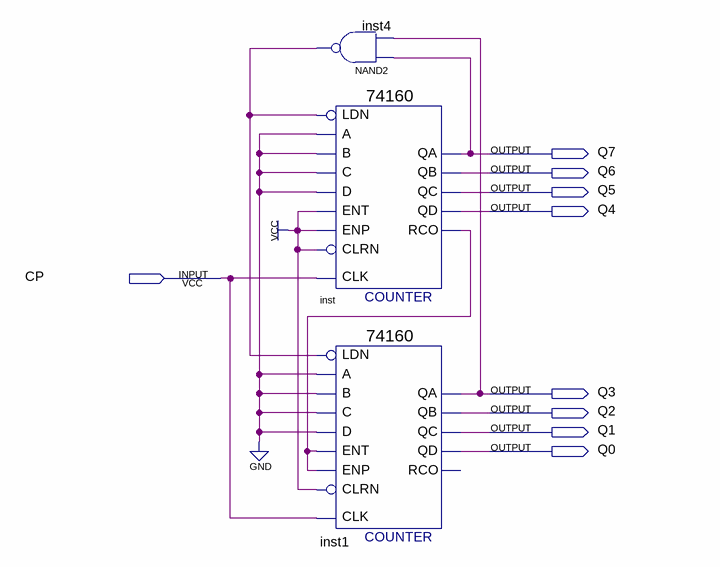
[diagram p0: schematic sheet]
// Quartus schematic Experiment71.bdf as structural Verilog: 3 symbols, 9 pins
module Experiment71 (
  input  CP,
  output Q7,
  output Q6,
  output Q5,
  output Q4,
  output Q3,
  output Q2,
  output Q1,
  output Q0
);

  wire inst4_out, inst_rco;

  nand inst4 (inst4_out, Q7, Q3);
  \74160  inst (
    .CLK(CP), .ENT(1'b1), .A(1'b0), .B(1'b0), .C(1'b0), .D(1'b0), .LDN(inst4_out), .ENP(1'b1), .CLRN(1'b1),
    .QD(Q4), .QA(Q7), .QB(Q6), .QC(Q5), .RCO(inst_rco));
  \74160  inst1 (
    .CLK(CP), .ENT(inst_rco), .A(1'b0), .B(1'b0), .C(1'b0), .D(1'b0), .LDN(inst4_out), .ENP(inst_rco),
    .CLRN(1'b1), .QD(Q0), .QA(Q3), .QB(Q2), .QC(Q1));  // open: RCO
endmodule
